# Altium schematic sheet Haut.SchDoc
size A4
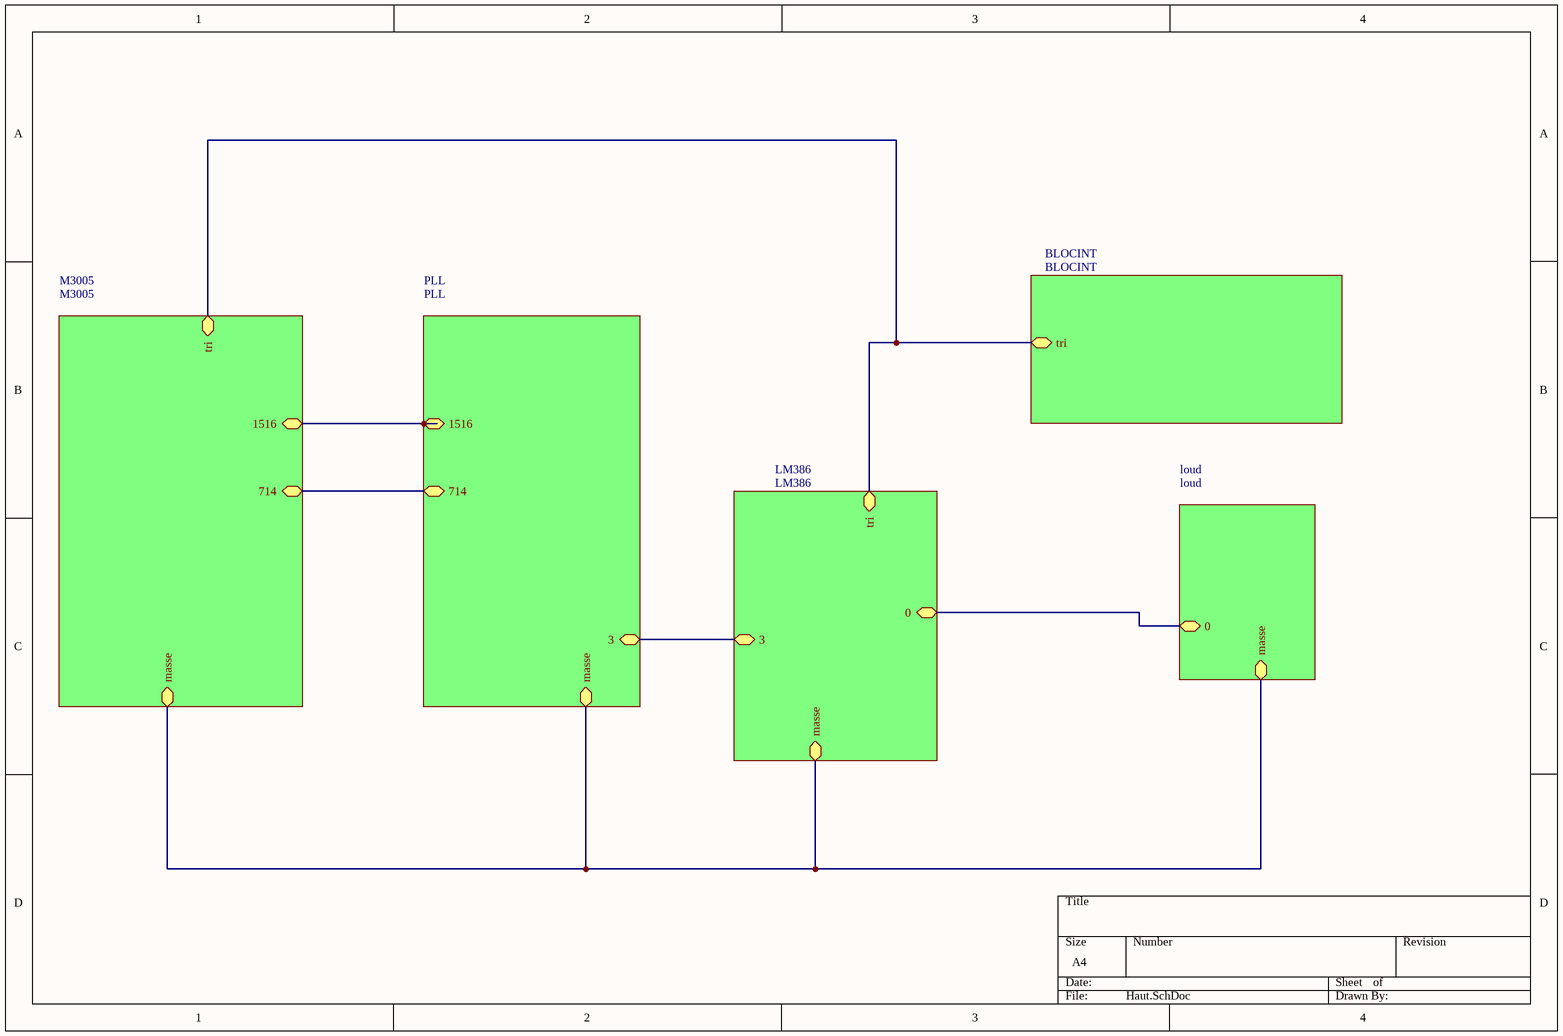
[diagram p0: Haut.SchDoc]

## Sub-sheets
BLOCINT = BLOCINT: tri
LM386 = LM386: tri, 3, masse, 0
loud = loud: 0, masse
M3005 = M3005: 1516, 714, masse, tri
PLL = PLL: 3, masse, 714, 1516

## Nets
(unnamed): sheet PLL/3, sheet LM386/3
(unnamed): sheet PLL/masse, sheet LM386/masse, sheet loud/masse, sheet M3005/masse
(unnamed): sheet PLL/714, sheet M3005/714
(unnamed): sheet PLL/1516, sheet M3005/1516
(unnamed): sheet BLOCINT/tri, sheet LM386/tri, sheet M3005/tri
(unnamed): sheet LM386/0, sheet loud/0